# EAGLE design schematic_slave2_rotary (EAGLE 9.6.2)
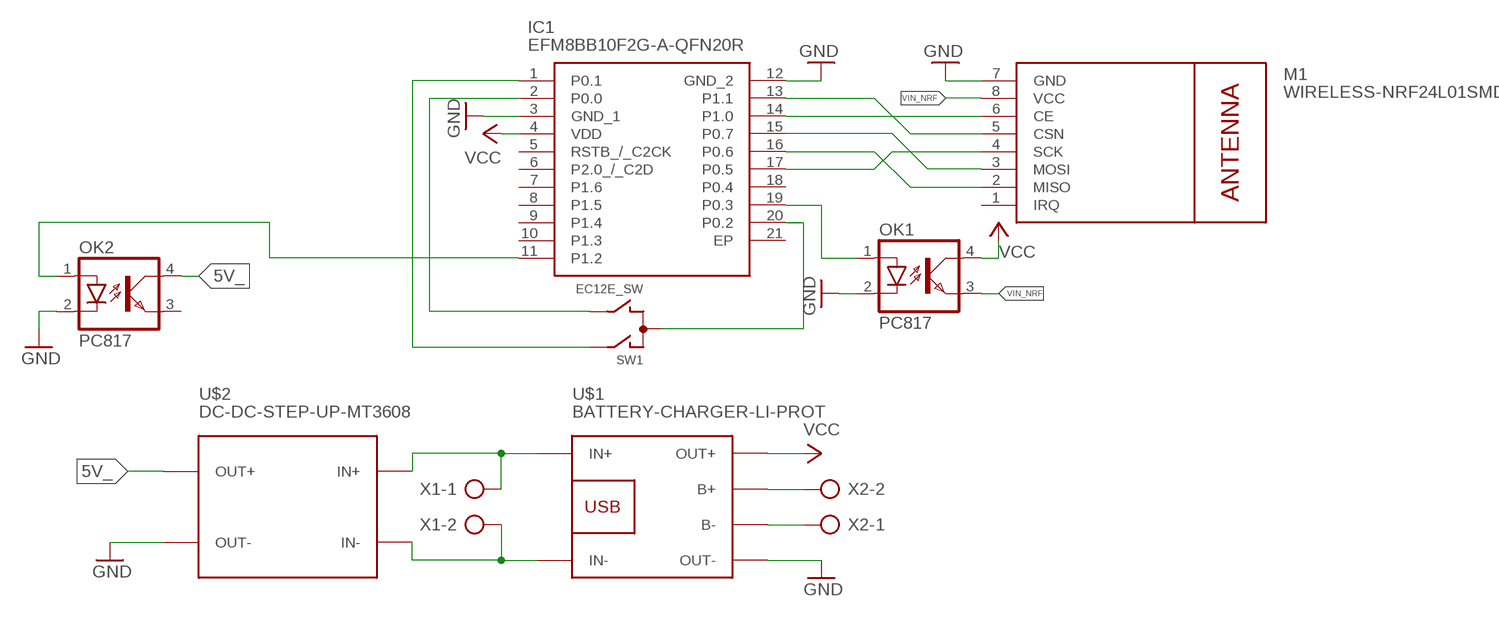
[diagram p0: schematic, sheet 1]

## Parts
IC1  EFM8BB10F2G-A-QFN20R  [EFM8BB10F2GAQFN20R]
M1  WIRELESS-NRF24L01SMD  [WIRELESS-NRF24L01-SMD]
OK1  PC817  [DIL04]
OK2  PC817  [DIL04]
SW1  EC12E_SW  [ALPS_EC12E_SW]
U$1  BATTERY-CHARGER-LI-PROT  [BATTERY-CHARGER-LI-PROT]
U$2  DC-DC-STEP-UP-MT3608  [DC-DC-STEP-UP-MT3608]
X1  AK500/2-H  [AK500/2-H]
X2  AK500/2-H  [AK500/2-H]

## Nets
5V_: OK2.4(COL) U$2.OUT+
GND: IC1.3(GND_1) IC1.12(GND_2) M1.7(GND) OK1.2(C) OK2.2(C) U$1.OUT- U$2.OUT-
IN+: U$1.IN+ U$2.IN+ X1.1
IN-: U$1.IN- U$2.IN- X1.2
N$1: IC1.11(P1.2) OK2.1(A)
N$2: IC1.2(P0.0) SW1.B
N$3: IC1.17(P0.5) M1.4(SCK)
N$4: IC1.16(P0.6) M1.2(MISO)
N$5: IC1.15(P0.7) M1.3(MOSI)
N$6: IC1.14(P1.0) M1.6(CE)
N$7: IC1.13(P1.1) M1.5(CSN)
N$8: IC1.19(P0.3) OK1.1(A)
N$9: U$1.B+ X2.2
N$10: IC1.1(P0.1) SW1.A
N$11: IC1.20(P0.2) SW1.C
N$12: U$1.B- X2.1
VCC: IC1.4(VDD) OK1.4(COL) U$1.OUT+
VIN_NRF: M1.8(VCC) OK1.3(EMIT)
Unconnected: IC1.5(RSTB_/_C2CK) IC1.6(P2.0_/_C2D) IC1.7(P1.6) IC1.8(P1.5) IC1.9(P1.4) IC1.10(P1.3) IC1.18(P0.4) IC1.21(EP) M1.1(IRQ) OK2.3(EMIT) SW1.D SW1.E SW1.GND1(G) SW1.GND2(G)

## Library data of the parts
IC1 = SamacSys_Parts:EFM8BB10F2G-A-QFN20R: 8-bit Microcontrollers - MCU 8051 25 MHz 2 kB fla sh 0.25 kB RAM 8-bi Source: Datasheet <https://www.silabs.com/documents/public/data-sheets/efm8bb1-datasheet.pdf>; DESCRIPTION: 8-bit Microcontrollers - MCU 8051 25 MHz 2 kB fla sh 0.25 kB RAM 8-bi; HEIGHT: 0.8mm; MANUFACTURER_NAME: Silicon Labs; MANUFACTURER_PART_NUMBER: EFM8BB10F2G-A-QFN20R; MOUSER_PART_NUMBER: 634-8BB10F2GAQF20R; MOUSER_PRICE-STOCK: https://www.mouser.co.uk/ProductDetail/Silicon-Labs/EFM8BB10F2G-A-QFN20R?qs=DCjbIwhU0ZtADu%252B55HsWtA%3D%3D
M1 = nrf24l01plus:WIRELESS-NRF24L01: 2.4 GHz Wireless Module based on NRF24L01 chip
OK1 OK2 = optocoupler:PC817: SHARP OPTO COUPLER; MPN: PC817X4J000F; OC_FARNELL: 9707727; OC_NEWARK: 97K7059
SW1 = switch-alps:EC12E_SW: ALPS rotary Encoder EC12E series with switch; MPN: EC12E2424407; OC_FARNELL: 1520813; OC_NEWARK: 74M1068
U$1 = diy-modules_1:BATTERY-CHARGER-LI-PROT: Lithium Battery 5V Charger with protection circuit More details available here: http://www.instructables.com/id/DIY-Lithium-ion-Battery-Charger/step4/TP4056-based-lithium-ion-battery-charger-module/ Click here to find device on ebay.com <http://www.ebay.com/sch/tp4056+charger+usb+protection>
U$2 = diy-modules_1:DC-DC-STEP-UP-MT3608: DC/DC Step-Up Regulator based on MT3608 chip MT3608 datasheet available here: https://www.olimex.com/Products/Breadboarding/BB-PWR-3608/resources/MT3608.pdf Click here to find device on ebay.com <http://www.ebay.com/sch/mt3608+module>
X1 X2 = con-ptr500:AK500/2-H: CONNECTOR Aug. 2004 / PTR Meßtechnik: Die Bezeichnung der Serie AK505 wurde geändert. Es handelt sich hierbei um AK500 in horizontaler Ausführung.; OC_FARNELL: unknown; OC_NEWARK: unknown

## Net classes
0 default: width 0.305 mm

## Board
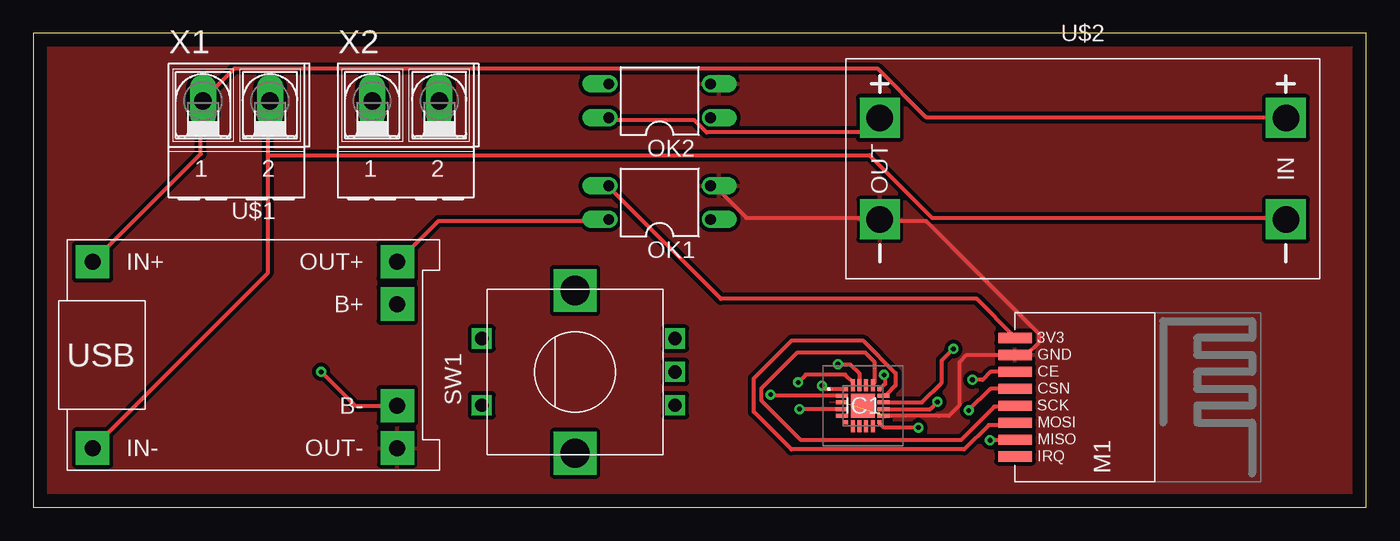
[diagram p1: board, top side]
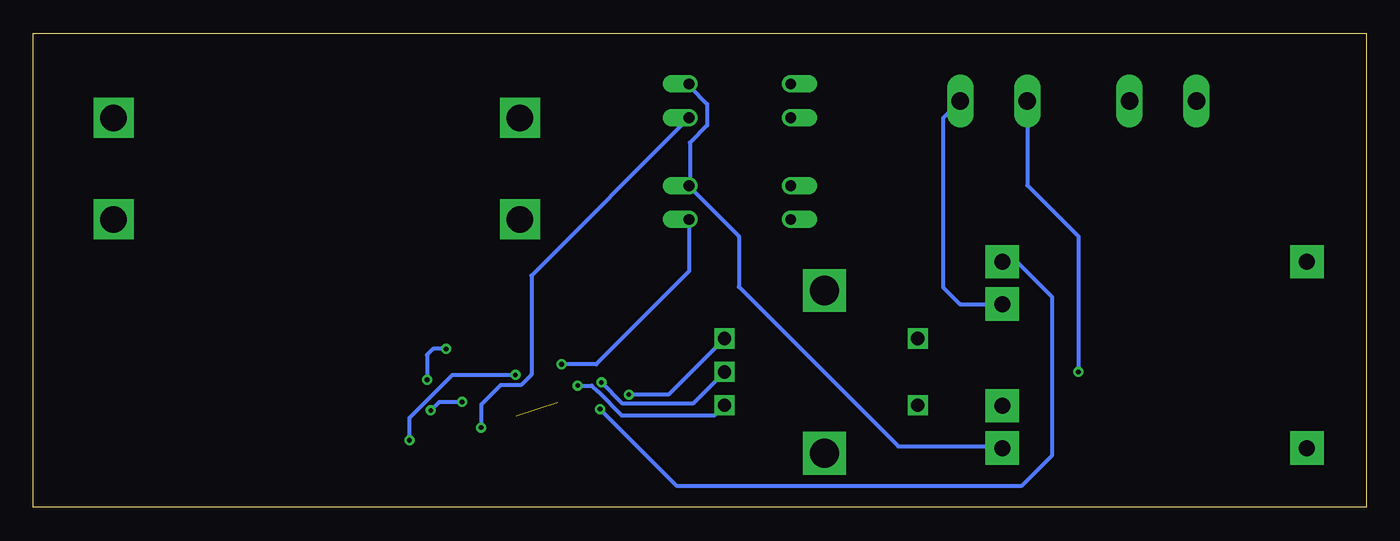
[diagram p2: board, bottom side, seen from below]

Size 100 x 35.55 mm. Coordinates in mm from the lower left corner, seen from the top.
Outline: 0,0 100,0 100,35.55 0,35.55 0,0
Copper layers (1*16): Top 0.035mm / dielectric 1.5mm / Bottom 0.035mm
Design rules "default": minimum track width 6mil, minimum drill 0.35mm, track to track 6mil, track to pad 6mil, pad to pad 6mil, via to via 6mil, smd to smd 6mil, copper to edge 40mil, drill to drill 6mil, minimum pad ring 10mil, minimum via ring 8mil, stop-mask expansion 4mil, vias tented up to drill 0mil, thermal gap 10mil

### Footprints (pad centres in the part's own frame; a part is rotated, then mirrored left to right if it is on the bottom)
EFM8BB10F2GAQFN20R = smd 0.3 x 0.3: 1 -1.25,1.25; 6 -1.25,-1.25; 11 1.25,-1.25; 16 1.25,1.25 | smd 0.9 x 0.3: 2 -1.55,0.75; 3 -1.55,0.25; 4 -1.55,-0.25; 5 -1.55,-0.75; 12 1.55,-0.75; 13 1.55,-0.25; 14 1.55,0.25; 15 1.55,0.75 | smd 0.3 x 0.9: 7 -0.75,-1.55; 8 -0.25,-1.55; 9 0.25,-1.55; 10 0.75,-1.55; 17 0.75,1.55; 18 0.25,1.55; 19 -0.25,1.55; 20 -0.75,1.55 | smd 1.8 x 1.8: 21 0,0
WIRELESS-NRF24L01-SMD = smd 2.54 x 0.762: 1 1.27,0; 2 1.27,1.27; 3 1.27,2.54; 4 1.27,3.81; 5 1.27,5.08; 6 1.27,6.35; 7 1.27,7.62; 8 1.27,8.89
DIL04 = drill 0.813 offset: 1 -1.27,-3.81; 2 1.27,-3.81; 3 1.27,3.81; 4 -1.27,3.81
ALPS_EC12E_SW = drill 1 square: A -2.5,-7.5; B 2.5,-7.5; C 0,-7.5; D -2.5,7; E 2.5,7 | drill 2.2 square: GND1 -6.1,0; GND2 6.1,0
BATTERY-CHARGER-LI-PROT = drill 1.2 pad 2.5 square: B+ 10.795,3.81; B- 10.795,-3.81; IN+ -12.065,6.985; IN- -12.065,-6.985; OUT+ 10.795,6.985; OUT- 10.795,-6.985
DC-DC-STEP-UP-MT3608 = drill 2 pad 2.8 square: IN+ 15.24,3.81; IN- 15.24,-3.81; OUT+ -15.24,3.81; OUT- -15.24,-3.81
AK500/2-H = drill 1.321 long: 1 -2.515,0; 2 2.515,0

### Placement (x,y rotation side)
IC1  62.23,7.62 0 top
M1  72.39,3.81 0 top
OK1  46.99,22.86 90 top
OK2  46.99,30.48 90 top
SW1  40.64,10.16 90 top
U$1  16.51,11.43 0 top
U$2  78.74,25.4 0 top
X1  15.24,30.48 0 top
X2  27.94,30.48 0 top

### Tracks (layer width: path | path; a pad name or v marks a point on that pad's centre or on a via)
5V_
  Top 0.305: U$2.OUT+ 62.41,28.12 50.52,28.12 49.61,29.03 43.2,29.03 OK2.4
GND  (1 unrouted)
  Top 0.305: IC1.12 67.96,6.87 67.97,6.86 68.68,6.86 69.5,7.68 69.5,10.91 70.02,11.43 M1.7 74.52,11.43 75.44,12.34 75.44,13.03 66.98,21.49 63.55,21.49 U$2.OUT- 63.32,21.72 53.49,21.72 50.98,24.23 OK1.2
  Bottom 0.305: OK2.2 50.75,31.55 49.45,30.25 49.45,28.65 50.75,27.35 50.75,24.23 OK1.2 50.75,24 47.07,20.33 47.07,16.54 35.11,4.57 27.43,4.57 U$1.OUT-
  pour Top (isolate 0.305): 0,35.56 100.33,35.56 100.33,0 0,0
IN+
  Top 0.305: U$1.IN+ 4.57,18.52 12.57,26.52 12.57,30.4 X1.1 12.8,30.63 15.09,32.92 63.32,32.92 66.98,29.26 93.95,29.26 U$2.IN+
IN-
  Top 0.305: 17.6,26.42 17.6,17.6 U$1.IN- | 17.6,26.42 17.6,30.4 X1.2 | 17.6,26.42 62.74,26.42 67.44,21.72 93.95,21.72 U$2.IN-
N$1  (via drill 0.35)
  Top 0.305: IC1.11 63.48,6.33 63.83,5.98 v66.4,5.98
  Bottom 0.305: OK2.1 62.64,17.37 62.64,9.95 63.41,9.17 64.94,9.17 66.4,7.71 v66.4,5.98
N$2  (via drill 0.35)
  Top 0.305: v55.32,8.46 55.42,8.36 IC1.2
  Bottom 0.305: v55.32,8.46 52.35,8.46 48.23,12.57 SW1.B
N$3
  Top 0.305: IC1.17 63.09,9.37 63.09,10.93 62.41,11.62 57.34,11.62 54.63,8.91 54.63,8 57.59,5.04 69.6,5.04 72.1,7.54 73.61,7.54 M1.4
N$4  (via drill 0.35)
  Top 0.305: v63.83,9.94 63.9,9.87 63.9,9.26 63.55,8.91 IC1.16 | v71.78,5.03 73.61,5.03 M1.2
  Bottom 0.305: v63.83,9.94 68.56,9.94 71.78,6.71 v71.78,5.03
N$5
  Top 0.305: IC1.15 64.01,8.46 64.69,9.14 64.69,10.06 62.24,12.52 56.91,12.52 54.06,9.67 54.06,7.16 56.87,4.35 69.86,4.35 71.68,6.17 73.61,6.17 M1.3
N$6  (via drill 0.35)
  Top 0.305: M1.6 71.82,10.16 71.23,9.56 v70.46,9.56 | IC1.14 66.68,7.87 68.16,9.36 68.16,11.02 v69.03,11.88
  Bottom 0.305: v69.03,11.88 70.02,11.88 70.46,11.44 v70.46,9.56
N$7  (via drill 0.35)
  Top 0.305: IC1.13 67.3,7.37 v67.83,7.91 | M1.5 71.79,8.89 70.17,7.27 v70.18,7.27
  Bottom 0.305: v70.18,7.27 69.54,7.92 67.84,7.92 v67.83,7.91
N$8  (via drill 0.35)
  Top 0.305: IC1.19 61.95,9.37 61.97,9.39 61.97,10.04 61.28,10.73 v60.37,10.73
  Bottom 0.305: 50.98,21.49 OK1.1 50.8,17.71 57.78,10.73 v60.37,10.73
N$9
  Bottom 0.305: X2.2 31.75,29.18 31.75,16.51 30.48,15.24 U$1.B+
N$10  (via drill 0.35)
  Top 0.305: IC1.1 59.42,8.87 v59.16,9.13
  Bottom 0.305: v59.16,9.13 58.1,9.13 57.66,8.69 57.65,8.69 55.86,6.9 48.9,6.9 SW1.A
N$11  (via drill 0.35)
  Top 0.305: IC1.20 61.48,9.38 60.91,9.96 57.96,9.96 v57.38,9.37
  Bottom 0.305: v57.38,9.37 55.78,7.77 50.52,7.77 48.23,10.06 SW1.C
N$12  (via drill 0.35)
  Top 0.305: v21.59,10.16 24.13,7.62 U$1.B-
  Bottom 0.305: X2.1 25.43,24.16 21.59,20.32 v21.59,10.16
VCC  (via drill 0.35)
  Top 0.305: OK1.4 42.98,21.49 30.4,21.49 27.43,18.52 U$1.OUT+ | IC1.4 v57.48,7.37
  Bottom 0.305: v57.48,7.37 51.75,1.64 25.82,1.64 23.54,3.92 23.54,15.77 26.19,18.41 U$1.OUT+
VIN_NRF
  Top 0.305: M1.8 73.61,12.8 70.78,15.63 51.58,15.63 43.2,24 OK1.3